# Altium project M3FMCWS.PrjPcb
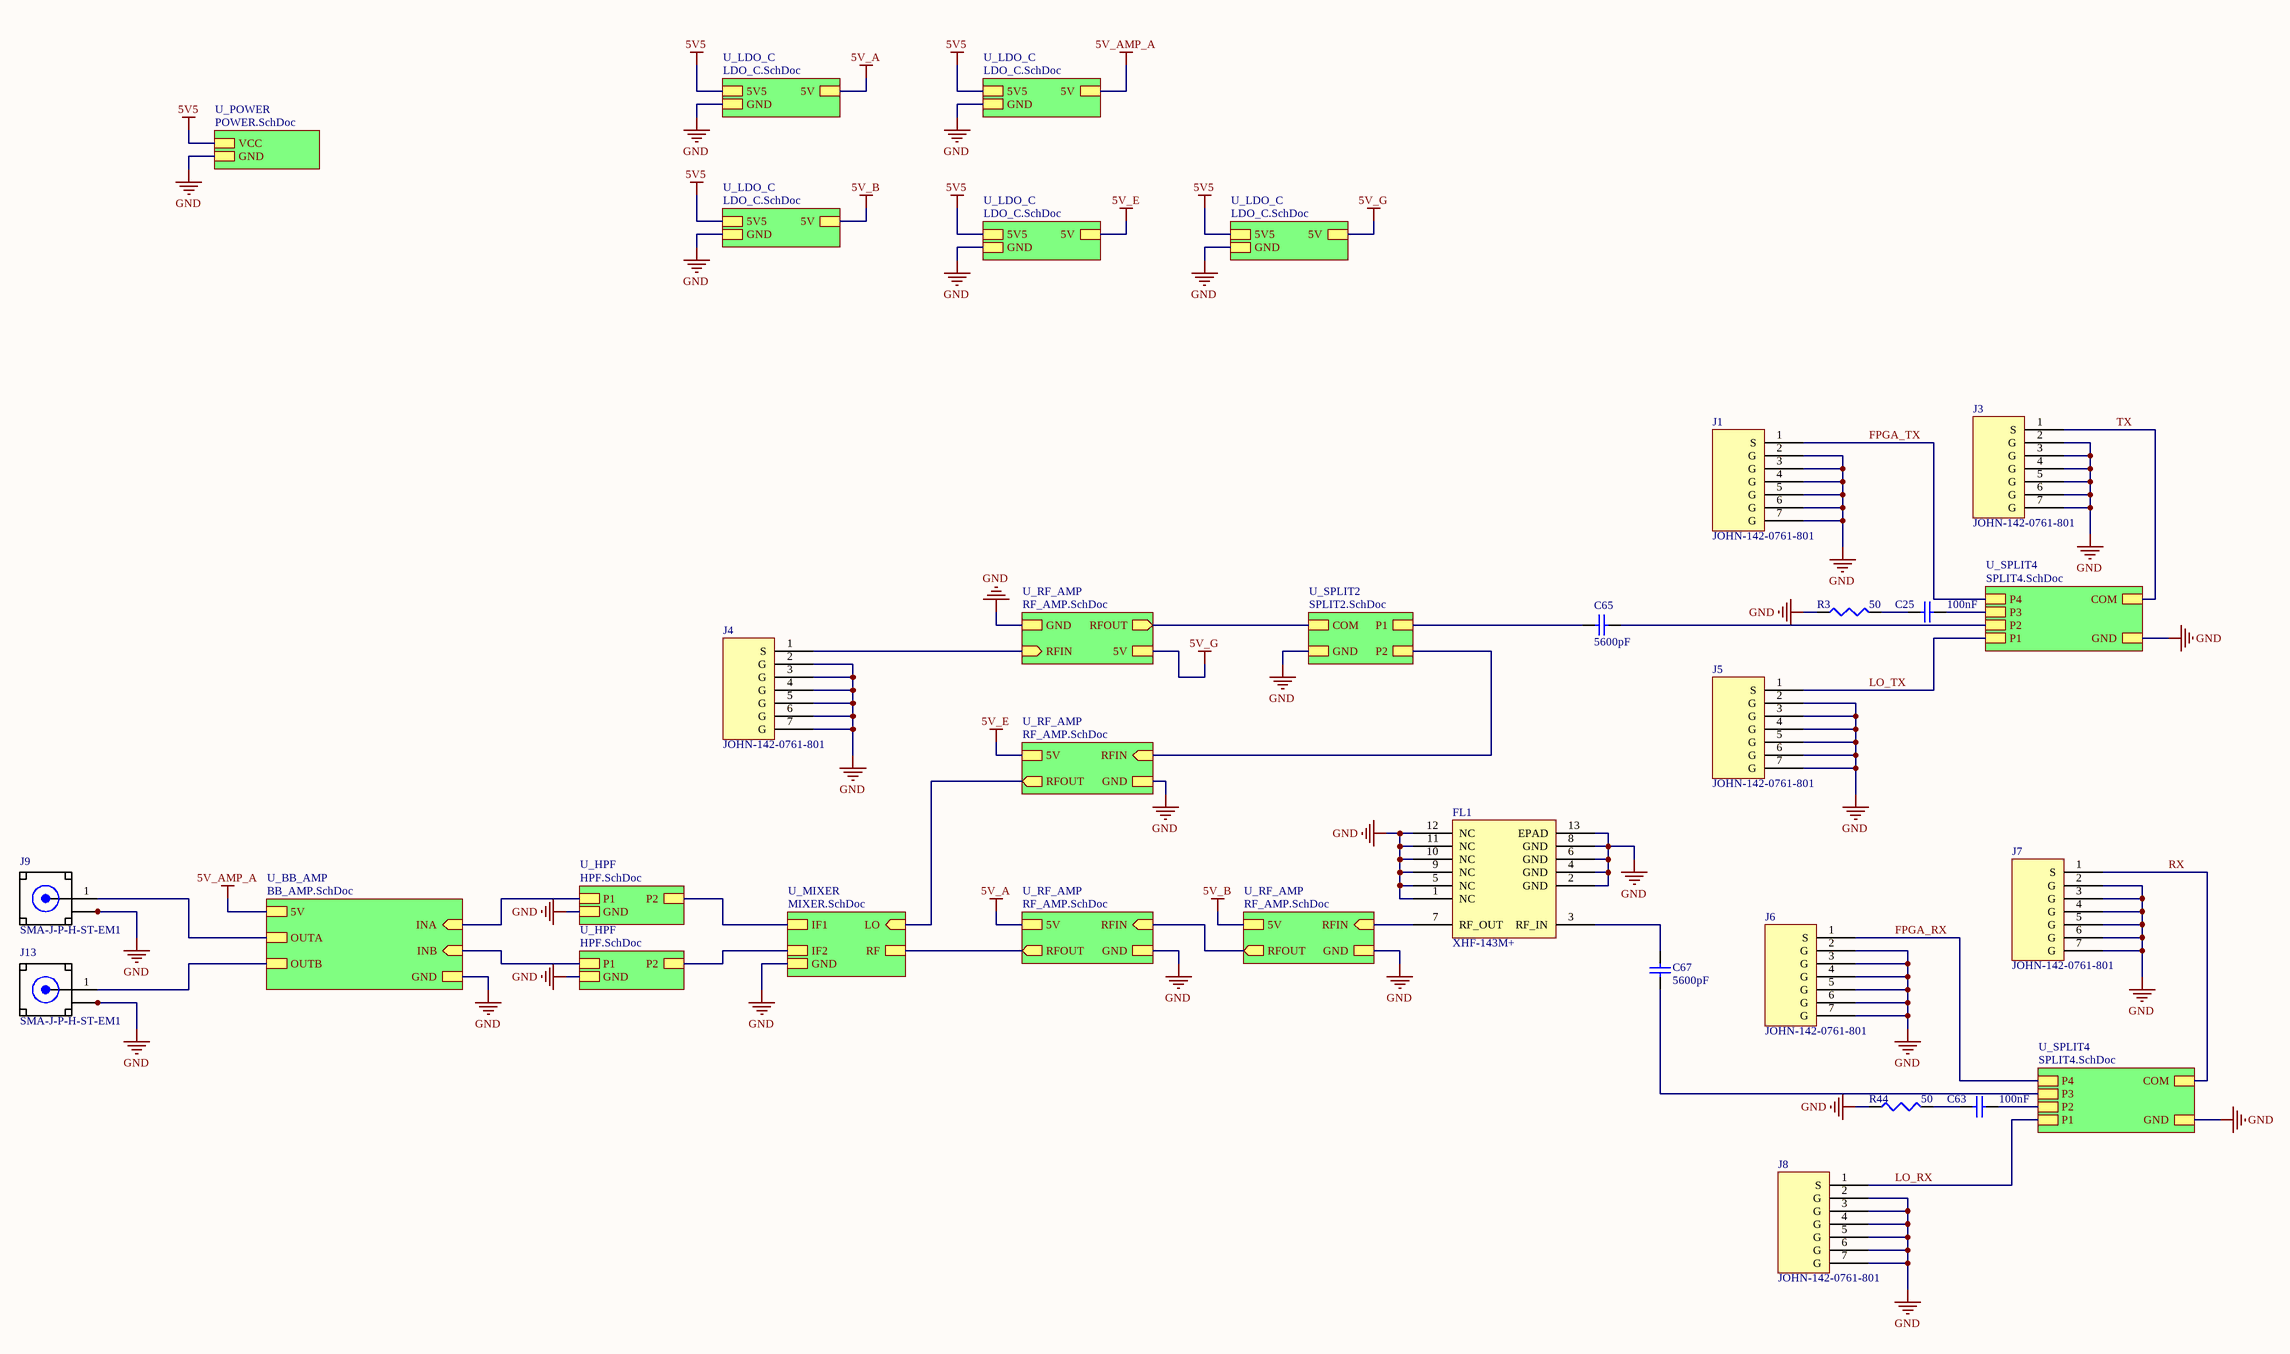
[diagram p0: M3_FMCW.SchDoc]
9 sheets, 145 parts. Net scope: strictly hierarchical (ports join the sheet entries above them; power ports are local).
Board file: M3FMCWS_B.PcbDoc
Sheets:
  M3_FMCW.SchDoc
    U_LDO_C = LDO_C.SchDoc
    U_POWER = POWER.SchDoc
    U_LDO_C = LDO_C.SchDoc
    U_MIXER = MIXER.SchDoc
    U_BB_AMP = BB_AMP.SchDoc
    U_LDO_C = LDO_C.SchDoc
    U_HPF = HPF.SchDoc
    U_HPF = HPF.SchDoc
    U_RF_AMP = RF_AMP.SchDoc
    U_RF_AMP = RF_AMP.SchDoc
    U_SPLIT4 = SPLIT4.SchDoc
    U_SPLIT4 = SPLIT4.SchDoc
    U_RF_AMP = RF_AMP.SchDoc
    U_LDO_C = LDO_C.SchDoc
    U_RF_AMP = RF_AMP.SchDoc
    U_LDO_C = LDO_C.SchDoc
    U_SPLIT2 = SPLIT2.SchDoc

## Sheet M3_FMCW.SchDoc
size C

### Parts
C25  100nF  [SMD-0402]
C63  100nF  [SMD-0402]
C65  5600pF  [Johanson-0201]
C67  5600pF  [Johanson-0201]
FL1  XHF-143M+  [PQFN12-XHF-143M]
J1  JOHN-142-0761-801  [JOHN-142-0761-801]
J3  JOHN-142-0761-801  [JOHN-142-0761-801]
J4  JOHN-142-0761-801  [JOHN-142-0761-801]
J5  JOHN-142-0761-801  [JOHN-142-0761-801]
J6  JOHN-142-0761-801  [JOHN-142-0761-801]
J7  JOHN-142-0761-801  [JOHN-142-0761-801]
J8  JOHN-142-0761-801  [JOHN-142-0761-801]
J9  SMA-J-P-H-ST-EM1  [SMA-J-P-H-ST-EM1]
J13  SMA-J-P-H-ST-EM1  [SMA-J-P-H-ST-EM1]
R3  50  [SMD-0402]
R44  50  [SMD-0402]

### Sub-sheets
U_BB_AMP = BB_AMP.SchDoc: OUTA, OUTB, INA (in), INB (in), 5V, GND
U_HPF = HPF.SchDoc: P1, P2, GND
U_HPF = HPF.SchDoc: P1, P2, GND
U_LDO_C = LDO_C.SchDoc: 5V, 5V5, GND
U_LDO_C = LDO_C.SchDoc: 5V, 5V5, GND
U_LDO_C = LDO_C.SchDoc: 5V, 5V5, GND
U_LDO_C = LDO_C.SchDoc: 5V, 5V5, GND
U_LDO_C = LDO_C.SchDoc: 5V, 5V5, GND
U_MIXER = MIXER.SchDoc: IF1, IF2, LO (in), RF, GND
U_POWER = POWER.SchDoc: GND, VCC
U_RF_AMP = RF_AMP.SchDoc: 5V, RFIN (in), RFOUT (out), GND
U_RF_AMP = RF_AMP.SchDoc: 5V, RFIN (in), RFOUT (out), GND
U_RF_AMP = RF_AMP.SchDoc: 5V, RFIN (in), RFOUT (out), GND
U_RF_AMP = RF_AMP.SchDoc: 5V, RFIN (in), RFOUT (out), GND
U_SPLIT2 = SPLIT2.SchDoc: COM, P1, P2, GND
U_SPLIT4 = SPLIT4.SchDoc: COM, P1, P2, P3, P4, GND
U_SPLIT4 = SPLIT4.SchDoc: COM, P1, P2, P3, P4, GND

### Nets
5V5: sheet U_LDO_C/5V5, sheet U_POWER/VCC, sheet U_LDO_C/5V5, sheet U_LDO_C/5V5, sheet U_LDO_C/5V5, sheet U_LDO_C/5V5
5V_A: sheet U_LDO_C/5V, sheet U_RF_AMP/5V  [project net 5V]
5V_AMP_A: sheet U_BB_AMP/5V, sheet U_LDO_C/5V  [project net 5V]
5V_B: sheet U_LDO_C/5V, sheet U_RF_AMP/5V  [project net 5V]
5V_E: sheet U_RF_AMP/5V, sheet U_LDO_C/5V  [project net 5V]
5V_G: sheet U_RF_AMP/5V, sheet U_LDO_C/5V  [project net 5V]
GND: FL1.1(NC) FL1.2(GND) FL1.4(GND) FL1.5(NC) FL1.6(GND) FL1.8(GND) FL1.9(NC) FL1.10(NC) FL1.11(NC) FL1.12(NC) FL1.13(EPAD) J1.2(G) J1.3(G) J1.4(G) J1.5(G) J1.6(G) J1.7(G) J3.2(G) J3.3(G) J3.4(G) J3.5(G) J3.6(G) J3.7(G) J4.2(G) J4.3(G) J4.4(G) J4.5(G) J4.6(G) J4.7(G) J5.2(G) J5.3(G) J5.4(G) J5.5(G) J5.6(G) J5.7(G) J6.2(G) J6.3(G) J6.4(G) J6.5(G) J6.6(G) J6.7(G) J7.2(G) J7.3(G) J7.4(G) J7.5(G) J7.6(G) J7.7(G) J8.2(G) J8.3(G) J8.4(G) J8.5(G) J8.6(G) J8.7(G) J9.2_1(GND) J9.2_2(GND) J9.3_1(GND) J9.3_2(GND) J13.2_1(GND) J13.2_2(GND) J13.3_1(GND) J13.3_2(GND) R3.1 R44.1 ; sheet U_LDO_C/GND, sheet U_POWER/GND, sheet U_LDO_C/GND, sheet U_MIXER/GND, sheet U_BB_AMP/GND, sheet U_LDO_C/GND, sheet U_HPF/GND, sheet U_HPF/GND, sheet U_RF_AMP/GND, sheet U_RF_AMP/GND, sheet U_SPLIT4/GND, sheet U_SPLIT4/GND, sheet U_RF_AMP/GND, sheet U_LDO_C/GND, sheet U_RF_AMP/GND, sheet U_LDO_C/GND, sheet U_SPLIT2/GND
FPGA_RX: J6.1(S) ; sheet U_SPLIT4/P4
FPGA_TX: J1.1(S) ; sheet U_SPLIT4/P4
LO_RX: J8.1(S) ; sheet U_SPLIT4/P1
LO_TX: J5.1(S) ; sheet U_SPLIT4/P1
RX: J7.1(S) ; sheet U_SPLIT4/COM
TX: J3.1(S) ; sheet U_SPLIT4/COM
NetC24_2: J9.1(SIGNAL) ; sheet U_BB_AMP/OUTA
NetC25_1: C25.1 R3.2
NetC25_2: C25.2 ; sheet U_SPLIT4/P3
NetC26_2: J13.1(SIGNAL) ; sheet U_BB_AMP/OUTB
NetC30_U_HPF1_1: sheet U_BB_AMP/INB, sheet U_HPF/P1
NetC30_U_HPF2_1: sheet U_BB_AMP/INA, sheet U_HPF/P1
NetC62_U_HPF1_2: sheet U_MIXER/IF2, sheet U_HPF/P2
NetC62_U_HPF2_2: sheet U_MIXER/IF1, sheet U_HPF/P2
NetC63_1: C63.1 R44.2
NetC63_2: C63.2 ; sheet U_SPLIT4/P2
NetC65_1: C65.1 ; sheet U_SPLIT4/P2
NetC65_2: C65.2 ; sheet U_SPLIT2/P1
NetC67_1: C67.1 ; sheet U_SPLIT4/P3
NetC67_2: C67.2 FL1.3(RF_IN)
NetFL1_7: FL1.7(RF_OUT) ; sheet U_RF_AMP/RFIN
NetJ4_1: J4.1(S) ; sheet U_RF_AMP/RFIN
NetU1_21: sheet U_RF_AMP/RFOUT, sheet U_SPLIT2/COM
NetU1_29: sheet U_RF_AMP/RFIN, sheet U_SPLIT2/P2
NetU19_16: sheet U_MIXER/RF, sheet U_RF_AMP/RFOUT
NetU19_23: sheet U_MIXER/LO, sheet U_RF_AMP/RFOUT
NetU20_U_RF_AMP3_5: sheet U_RF_AMP/RFIN, sheet U_RF_AMP/RFOUT

### Notes on the sheet
- Title
- Size:
- Date:
- File:
- C
- Number:
- Time:
- Revision:
- Sheet
- of

### Library data of the parts
C25 C63 = CAP_RF_0402: Broadband Ceramic Capacitor X7R 0402 (1005 Metric)
C65 C67 = CAP_RF_0201: Broadband Capacitor 0201 Imperial
FL1 = XHF-143M+: Reflectionless High Pass Filter 50Ω 13900 to19000 MHz
J1 J3-J8 = JOHN-142-0761-801: CONN SMA JACK STR 50OHM EDGE MNT
J9 J13 = SMA-J-P-H-ST-EM1: Connector SMA F 50Ohm Solder ST Edge Mount Gold Over Nickel Tray; MF: Samtec; Price: None; SnapEDA_Link: https://www.snapeda.com/parts/SMA-J-P-H-ST-EM1/Samtec%20Inc./view-part/?ref=snap; MP: SMA-J-P-H-ST-EM1; Package: None; Availability: Unavailable; Value: *
R3 R44 = RES_RF_0402: High Frequency Resistor 0402

## Sheet LDO_C.SchDoc
size B; Organization: Altium Limited; Address1: L3, 12a Rodborough Rd; Address2: Frenchs Forest; Address3: NSW; Address4: Australia 2086
Used 5 times, as channels U_LDO_C, U_LDO_C, U_LDO_C, U_LDO_C, U_LDO_C. Parts and nets are listed once, with the designators drawn on the sheet.
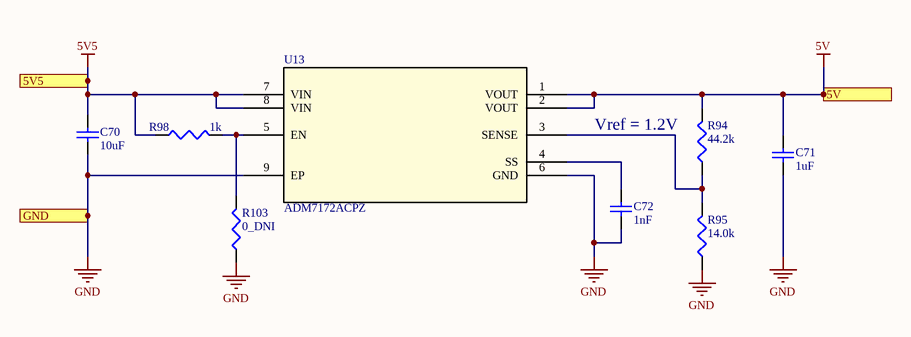
[diagram p1: LDO_C.SchDoc]

### Parts
C70  10uF  [SMD-0603]
C71  1uF  [SMD-0603]
C72  1nF  [SMD-0603]
R94  44.2k  [SMD-0603]
R95  14.0k  [SMD-0603]
R98  1k  [SMD-0603]
R103  0_DNI  [SMD-0603]
U13  ADM7172ACPZ  [LFCSP_WD-8]

### Ports
5V, 5V5, GND

### Nets
5V: C71.2 R94.2 U13.1(VOUT) U13.2(VOUT) ; port 5V
5V5: C70.2 R98.1 U13.7(VIN) U13.8(VIN) ; port 5V5
GND: C70.1 C71.1 C72.2 R95.1 R103.1 U13.6(GND) U13.9(EP) ; port GND
NetC72_1: C72.1 U13.4(SS)
NetR94_1: R94.1 R95.2 U13.3(SENSE)
NetR98_2: R98.2 R103.2 U13.5(EN)

### Channels
U_LDO_C: designators end in _U_LDO_C5; ports 5V5=5V5 5V=5V GND=GND
U_LDO_C: designators end in _U_LDO_C4; ports 5V5=5V5 5V=5V GND=GND
U_LDO_C: designators end in _U_LDO_C3; ports 5V5=5V5 5V=5V GND=GND
U_LDO_C: designators end in _U_LDO_C2; ports 5V5=5V5 5V=5V GND=GND
U_LDO_C: designators end in _U_LDO_C1; ports 5V5=5V5 5V=5V GND=GND

### Notes on the sheet
- (near R94) Vref = 1.2V
- Title
- Size:
- Date:
- B
- Number:
- Time:
- Revision:
- Sheet
- of
- File:

### Library data of the parts
C70-C72 = CAP0603: Ceramic Capacitor 0603
R94 R95 R98 R103 = RES0603: Resistor-0603
U13 = ADM7172ACPZ: 6.5V, 2A, Ultralow Noise, High PSRR, Fast Transient Response CMOS LDO; Value: Value; Type: Type; RefDes: RefDes

## Sheet POWER.SchDoc
size B
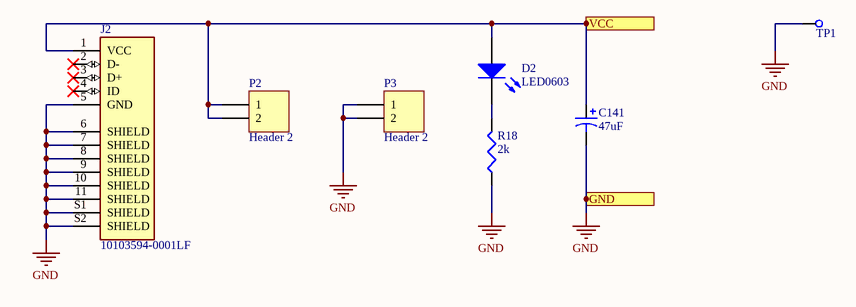
[diagram p2: POWER.SchDoc]

### Parts
C141  47uF  [CAP_TANT_1206_POL]
D2  LED0603  [LED-SMD-0603]
J2  10103594-0001LF  [AMPHENOL_10103594-0001LF]
P2  Header 2  [HDR1X2]
P3  Header 2  [HDR1X2]
R18  2k  [SMD-0402]
TP1  TSW-101-15-T-S  [TSW-101-15-T-S]  (value not drawn)

### Ports
GND, VCC

### Nets
5V5: C141.1 D2.1(A) J2.1(VCC) P2.1 P2.2 ; port VCC
GND: C141.2 J2.5(GND) J2.6(SHIELD) J2.7(SHIELD) J2.8(SHIELD) J2.9(SHIELD) J2.10(SHIELD) J2.11(SHIELD) J2.S1(SHIELD) J2.S2(SHIELD) P3.1 P3.2 R18.1 TP1.1 ; port GND
NetD2_2: D2.2(K) R18.2

Not connected (* = marked no-connect by the designer): J2 2(D-)* 3(D+)* 4(ID)*

### Notes on the sheet
- Title
- Size:
- Date:
- B
- Number:
- Time:
- Revision:
- Sheet
- of
- File:

### Library data of the parts
C141 = CAP_TANT_1206: Polarized Cap, Size 1206 Imperial (3216 Metric), Tantalum
D2 = LED0603: LED 0603
J2 = 10103594-0001LF: USB - micro B USB 2.0 Receptacle Connector 5 Position Surface Mount, Right Angle; Through Hole; MF: Amphenol ICC (FCI); Package: None; MP: 10103594-0001LF; Check_prices: https://www.snapeda.com/parts/10103594-0001LF/Amphenol%20FCI/view-part/5161044/?ref=eda; Purchase-URL: https://pricing.snapeda.com/search/part/10103594-0001LF/?ref=eda; Value: *; Availability: Good; Price: None; SnapEDA_Link: https://www.snapeda.com/parts/10103594-0001LF/Amphenol%20FCI/view-part/5161044/?ref=snap
P2 P3 = Header 2: Header, 2-Pin; LatestRevisionDate: 17-Jul-2002; LatestRevisionNote: Re-released for DXP Platform.; Publisher: Altium Limited
R18 = RES0402: Resistor-0402
TP1 = TSW-101-15-T-S: CONN HEADER VERT 1POS

## Sheet MIXER.SchDoc
size 431 x 279 mm
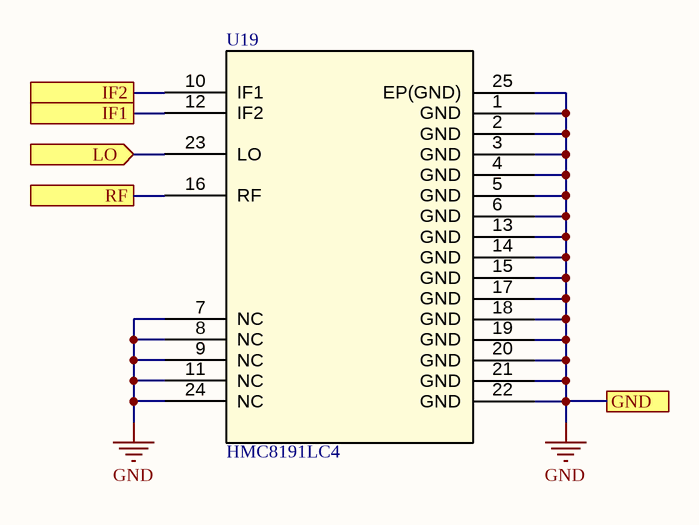
[diagram p3: MIXER.SchDoc]

### Parts
U19  HMC8191LC4  [HMC8191_E-24-1]

### Ports
GND, IF1, IF2, LO (in), RF

### Nets
GND: U19.1(GND) U19.2(GND) U19.3(GND) U19.4(GND) U19.5(GND) U19.6(GND) U19.7(NC) U19.8(NC) U19.9(NC) U19.11(NC) U19.13(GND) U19.14(GND) U19.15(GND) U19.17(GND) U19.18(GND) U19.19(GND) U19.20(GND) U19.21(GND) U19.22(GND) U19.24(NC) U19.25(EP(GND)) ; port GND
NetC62_U_HPF1_2: U19.10(IF1) ; port IF2
NetC62_U_HPF2_2: U19.12(IF2) ; port IF1
NetU19_16: U19.16(RF) ; port RF
NetU19_23: U19.23(LO) ; port LO

### Notes on the sheet
- DWG. NO.
- REV.
- SHT.
- THIS DOCUMENT AND THE DATA DISCLOSED HEREIN OR HEREWITH IS THE PROPERTY OF ALTIUM LIMITED AND MAY BE FREELY DISTRIBUTED IN WHOLE. NO RIGHTS ARE RESERVED OR EXPRESS OR IMPLIED WARANTEE GIVEN.
- REVISION
- DESCRIPTION
- DATE
- APPROVED
- ENG:
- APPROVALS
- PROJECT
- DSN:
- CHK:
- REFERENCE DOCUMENTS
- PROJECT REVISION:
- TITLE
- DOCUMENT REVISION:
- DESIGN ITEM:
- BOM:
- FAB DWG:
- PCB DWG:
- ASSY DWG:
- SCALE:
- SIZE
- B
- CAGE CODE
- FILE NAME
- DWG NO.
- SHEET
- OF
- REV

### Library data of the parts
U19 = HMC8191LC4: 6 GHz to 26.5 GHz, / Wideband I/Q Mixer; Copyright: Copyright (C) 2018 Accelerated Designs. All rights reserved; RefDes: RefDes; Type: DEV

## Sheet BB_AMP.SchDoc
size 431 x 279 mm
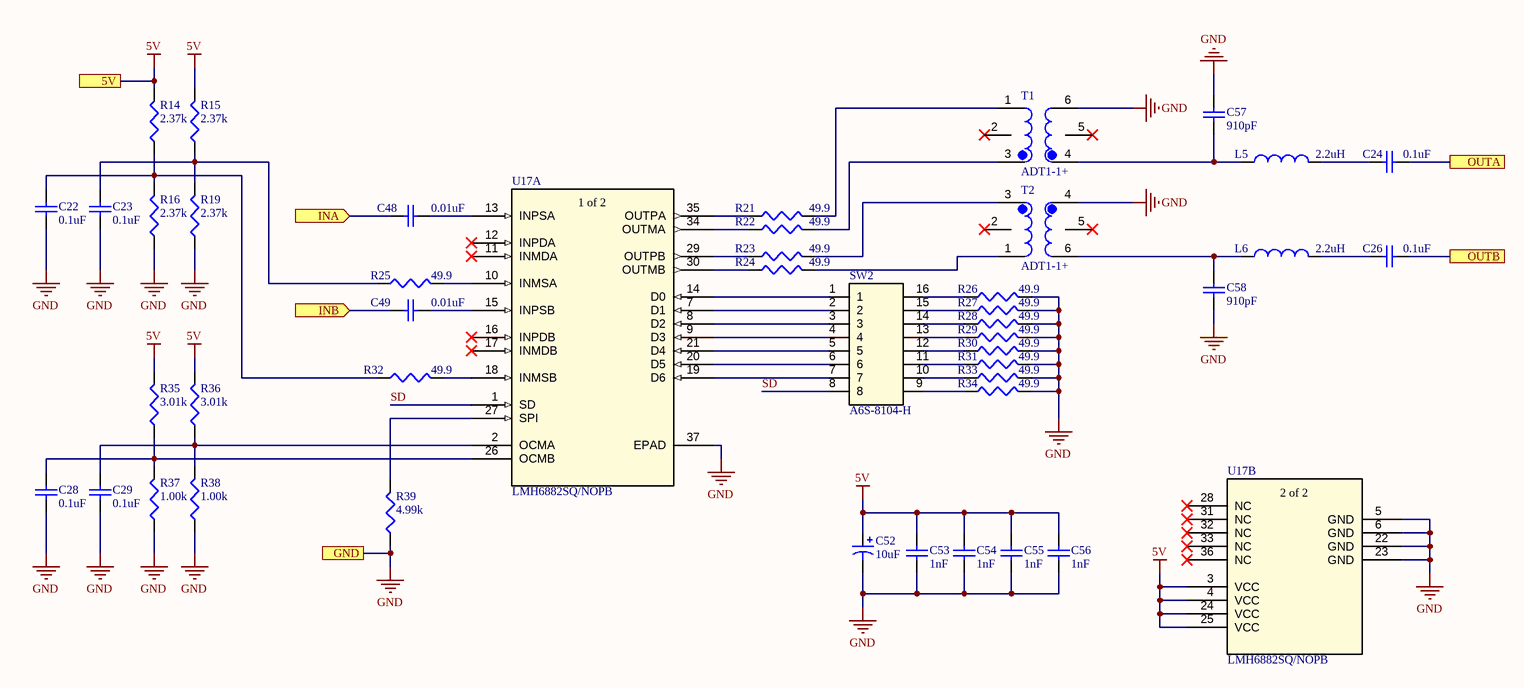
[diagram p4: BB_AMP.SchDoc]

### Parts
C22  0.1uF  [SMD-0603]
C23  0.1uF  [SMD-0603]
C24  0.1uF  [SMD-0603]
C26  0.1uF  [SMD-0603]
C28  0.1uF  [SMD-0603]
C29  0.1uF  [SMD-0603]
C48  0.01uF  [SMD-0402]
C49  0.01uF  [SMD-0402]
C52  10uF  [CAP_TANT_1206_POL]
C53  1nF  [SMD-0402]
C54  1nF  [SMD-0402]
C55  1nF  [SMD-0402]
C56  1nF  [SMD-0402]
C57  910pF  [SMD-0603]
C58  910pF  [SMD-0603]
L5  2.2uH  [SMD-0603]
L6  2.2uH  [SMD-0603]
R14  2.37k  [SMD-0603]
R15  2.37k  [SMD-0603]
R16  2.37k  [SMD-0603]
R19  2.37k  [SMD-0603]
R21  49.9  [SMD-0402]
R22  49.9  [SMD-0402]
R23  49.9  [SMD-0402]
R24  49.9  [SMD-0402]
R25  49.9  [SMD-0402]
R26  49.9  [SMD-0603]
R27  49.9  [SMD-0603]
R28  49.9  [SMD-0603]
R29  49.9  [SMD-0603]
R30  49.9  [SMD-0603]
R31  49.9  [SMD-0603]
R32  49.9  [SMD-0402]
R33  49.9  [SMD-0603]
R34  49.9  [SMD-0603]
R35  3.01k  [SMD-0603]
R36  3.01k  [SMD-0603]
R37  1.00k  [SMD-0603]
R38  1.00k  [SMD-0603]
R39  4.99k  [SMD-0603]
SW2  A6S-8104-H  [A6S-8101-H]
T1  ADT1-1+  [XFMR_ADT1-1+]
T2  ADT1-1+  [XFMR_ADT1-1+]
U17  LMH6882SQ/NOPB  [NJK36_TEX]  (parts A,B of 2)

### Ports
5V, GND, INA (in), INB (in), OUTA, OUTB

### Nets
5V: C52.1 C53.2 C54.2 C55.2 C56.2 R14.2 R15.2 R35.2 R36.2 U17.3(VCC) U17.4(VCC) U17.24(VCC) U17.25(VCC) ; port 5V
GND: C22.1 C23.1 C28.1 C29.1 C52.2 C53.1 C54.1 C55.1 C56.1 C57.2 C58.1 R16.1 R19.1 R26.2 R27.2 R28.2 R29.2 R30.2 R31.2 R33.2 R34.2 R37.1 R38.1 R39.1 T1.6 T2.4 U17.5(GND) U17.6(GND) U17.22(GND) U17.23(GND) U17.37(EPAD) ; port GND
SD: SW2.8 U17.1(SD)
NetC22_2: C22.2 R14.1 R16.2 R32.1
NetC23_2: C23.2 R15.1 R19.2 R25.1
NetC24_1: C24.1 L5.2
NetC24_2: C24.2 ; port OUTA
NetC26_1: C26.1 L6.2
NetC26_2: C26.2 ; port OUTB
NetC28_2: C28.2 R35.1 R37.2 U17.26(OCMB)
NetC29_2: C29.2 R36.1 R38.2 U17.2(OCMA)
NetC30_U_HPF1_1: C49.1 ; port INB
NetC30_U_HPF2_1: C48.1 ; port INA
NetC48_2: C48.2 U17.13(INPSA)
NetC49_2: C49.2 U17.15(INPSB)
NetC57_1: C57.1 L5.1 T1.4
NetC58_2: C58.2 L6.1 T2.6
NetR21_1: R21.1 U17.35(OUTPA)
NetR21_2: R21.2 T1.1
NetR22_1: R22.1 U17.34(OUTMA)
NetR22_2: R22.2 T1.3
NetR23_1: R23.1 U17.29(OUTPB)
NetR23_2: R23.2 T2.3
NetR24_1: R24.1 U17.30(OUTMB)
NetR24_2: R24.2 T2.1
NetR25_2: R25.2 U17.10(INMSA)
NetR26_1: R26.1 SW2.16
NetR27_1: R27.1 SW2.15
NetR28_1: R28.1 SW2.14
NetR29_1: R29.1 SW2.13
NetR30_1: R30.1 SW2.12
NetR31_1: R31.1 SW2.11
NetR32_2: R32.2 U17.18(INMSB)
NetR33_1: R33.1 SW2.10
NetR34_1: R34.1 SW2.9
NetR39_2: R39.2 U17.27(SPI)
NetSW2_1: SW2.1 U17.14(D0)
NetSW2_2: SW2.2 U17.7(D1)
NetSW2_3: SW2.3 U17.8(D2)
NetSW2_4: SW2.4 U17.9(D3)
NetSW2_5: SW2.5 U17.21(D4)
NetSW2_6: SW2.6 U17.20(D5)
NetSW2_7: SW2.7 U17.19(D6)

Not connected (* = marked no-connect by the designer): T1 2(NC)* 5*; T2 2(NC)* 5*; U17 11(INMDA)* 12(INPDA)* 16(INPDB)* 17(INMDB)* 28(NC)* 31(NC)* 32(NC)* 33(NC)* 36(NC)*

### Notes on the sheet
- DWG. NO.
- REV.
- SHT.
- THIS DOCUMENT AND THE DATA DISCLOSED HEREIN OR HEREWITH IS THE PROPERTY OF ALTIUM LIMITED AND MAY BE FREELY DISTRIBUTED IN WHOLE. NO RIGHTS ARE RESERVED OR EXPRESS OR IMPLIED WARANTEE GIVEN.
- REVISION
- DESCRIPTION
- DATE
- APPROVED
- ENG:
- APPROVALS
- PROJECT
- DSN:
- CHK:
- REFERENCE DOCUMENTS
- PROJECT REVISION:
- TITLE
- DOCUMENT REVISION:
- DESIGN ITEM:
- BOM:
- FAB DWG:
- PCB DWG:
- ASSY DWG:
- SCALE:
- SIZE
- B
- CAGE CODE
- FILE NAME
- DWG NO.
- SHEET
- OF
- REV
- (in symbol LMH6882, part A) 1 of 2
- (in symbol LMH6882, part B) 2 of 2

### Library data of the parts
C22-C24 C26 C28 C29 C57 C58 = CAP0603: Ceramic Capacitor 0603
C48 C49 C53-C56 = CAP0402: Ceramic Capacitor 0402
C52 = CAP_TANT_1206: as C141 on sheet POWER
L5 L6 = L0603: Inductor 0603
R14-R16 R19 R26-R31 R33-R39 = RES0603: Resistor-0603
R21-R25 R32 = RES0402: Resistor-0402
SW2 = A6S-8104-H: Dip Switch SPST 8 Position Surface Mount Slide (Standard) Actuator 25mA 24VDC; Vendor: Omron; Built_By: EMA_Kyle; SourceLibrary: Omron_2019-09-26; Manufacturer_Part_Number: A6S-8104-H; Copyright: Copyright (C) 2018 Accelerated Designs. All rights reserved; RefDes: RefDes; Type: DEV
T1 T2 = ADT1-1+: RF Transformer, 50 ohm, 1:1, 0.15-400 MHz, SMT; MP: ADT1-6T+; MF: Mini-Circuits; SnapEDA_Link: https://www.snapeda.com/parts/ADT1-6T+/Mini-Circuits/view-part/948642/?ref=snap; Availability: Unavailable; Price: None; Value: *; Package: None
U17 = LMH6882: LMH6882 DC to 2.4-GHz, High-Linearity, Dual, Programmable Differential Amplifier; SourceLibrary: TI_2017-02-16; Built_By: EMA_UL_Team; Vendor: Texas Instruments; Manufacturer_Part_Number: LMH6882SQ/NOPB; Copyright: Copyright (C) 2018 Accelerated Designs. All rights reserved; RefDes: RefDes; Type: DEV

## Sheet HPF.SchDoc
size 431 x 279 mm
Used 2 times, as channels U_HPF, U_HPF. Parts and nets are listed once, with the designators drawn on the sheet.
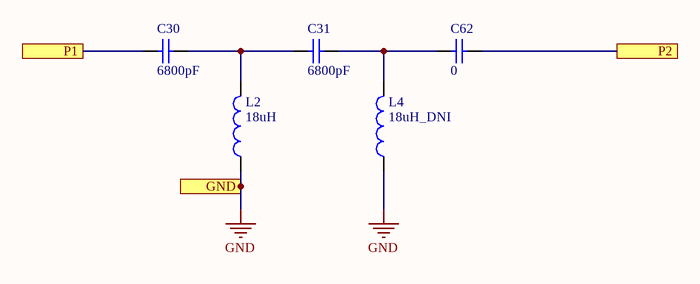
[diagram p5: HPF.SchDoc]

### Parts
C30  6800pF  [SMD-0603]
C31  6800pF  [SMD-0603]
C62  0  [SMD-0603]
L2  18uH  [SMD-0603]
L4  18uH_DNI  [SMD-0603]

### Ports
GND, P1, P2

### Nets
GND: L2.1 L4.1 ; port GND
P1: C30.1 ; port P1
P2: C62.2 ; port P2
NetC30_2: C30.2 C31.1 L2.2
NetC31_2: C31.2 C62.1 L4.2

### Channels
U_HPF: designators end in _U_HPF2; ports GND=GND P1=NetC30_U_HPF2_1 P2=NetC62_U_HPF2_2
U_HPF: designators end in _U_HPF1; ports GND=GND P1=NetC30_U_HPF1_1 P2=NetC62_U_HPF1_2

### Notes on the sheet
- DWG. NO.
- REV.
- SHT.
- THIS DOCUMENT AND THE DATA DISCLOSED HEREIN OR HEREWITH IS THE PROPERTY OF ALTIUM LIMITED AND MAY BE FREELY DISTRIBUTED IN WHOLE. NO RIGHTS ARE RESERVED OR EXPRESS OR IMPLIED WARANTEE GIVEN.
- REVISION
- DESCRIPTION
- DATE
- APPROVED
- ENG:
- APPROVALS
- PROJECT
- DSN:
- CHK:
- REFERENCE DOCUMENTS
- PROJECT REVISION:
- TITLE
- DOCUMENT REVISION:
- DESIGN ITEM:
- BOM:
- FAB DWG:
- PCB DWG:
- ASSY DWG:
- SCALE:
- SIZE
- B
- CAGE CODE
- FILE NAME
- DWG NO.
- SHEET
- OF
- REV

### Library data of the parts
C30 C31 C62 = CAP0603: Ceramic Capacitor 0603
L2 L4 = L0603: Inductor 0603

## Sheet RF_AMP.SchDoc
size 431 x 279 mm
Used 4 times, as channels U_RF_AMP, U_RF_AMP, U_RF_AMP, U_RF_AMP. Parts and nets are listed once, with the designators drawn on the sheet.
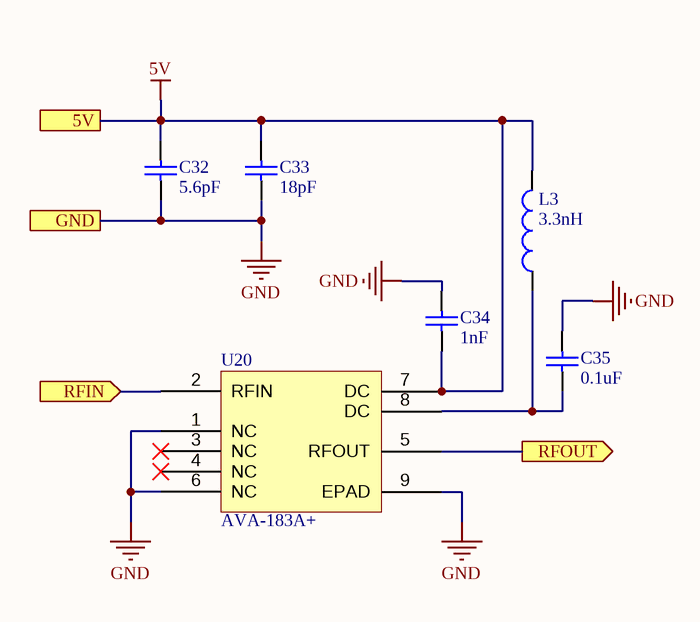
[diagram p6: RF_AMP.SchDoc]

### Parts
C32  5.6pF  [SMD-0402]
C33  18pF  [SMD-0402]
C34  1nF  [SMD-0402]
C35  0.1uF  [SMD-0402]
L3  3.3nH  [SMD-0805]
U20  AVA-183A+  [AVA-183A+ QFN]

### Ports
5V, GND, RFIN (in), RFOUT (out)

### Nets
5V: C32.2 C33.2 C34.1 L3.2 U20.7(DC) ; port 5V
GND: C32.1 C33.1 C34.2 C35.2 U20.1(NC) U20.6(NC) U20.9(EPAD) ; port GND
RFIN: U20.2(RFIN) ; port RFIN
RFOUT: U20.5(RFOUT) ; port RFOUT
NetC35_1: C35.1 L3.1 U20.8(DC)

Not connected (* = marked no-connect by the designer): U20 3(NC)* 4(NC)*

### Channels
U_RF_AMP: designators end in _U_RF_AMP4; ports 5V=5V GND=GND RFIN=NetU20_U_RF_AMP3_5 RFOUT=NetU19_16
U_RF_AMP: designators end in _U_RF_AMP3; ports 5V=5V GND=GND RFIN=NetFL1_7 RFOUT=NetU20_U_RF_AMP3_5
U_RF_AMP: designators end in _U_RF_AMP2; ports 5V=5V GND=GND RFIN=NetU1_29 RFOUT=NetU19_23
U_RF_AMP: designators end in _U_RF_AMP1; ports 5V=5V GND=GND RFIN=NetJ4_1 RFOUT=NetU1_21

### Notes on the sheet
- DWG. NO.
- REV.
- SHT.
- THIS DOCUMENT AND THE DATA DISCLOSED HEREIN OR HEREWITH IS THE PROPERTY OF ALTIUM LIMITED AND MAY BE FREELY DISTRIBUTED IN WHOLE. NO RIGHTS ARE RESERVED OR EXPRESS OR IMPLIED WARANTEE GIVEN.
- REVISION
- DESCRIPTION
- DATE
- APPROVED
- ENG:
- APPROVALS
- PROJECT
- DSN:
- CHK:
- REFERENCE DOCUMENTS
- PROJECT REVISION:
- TITLE
- DOCUMENT REVISION:
- DESIGN ITEM:
- BOM:
- FAB DWG:
- PCB DWG:
- ASSY DWG:
- SCALE:
- SIZE
- B
- CAGE CODE
- FILE NAME
- DWG NO.
- SHEET
- OF
- REV

### Library data of the parts
C32-C35 = CAP0402: Ceramic Capacitor 0402
L3 = L0805: Inductor 0805
U20 = AVA-183A+: Wideband, Microwave, Monolithic Amplifier, 50Ω, 5 to 18 GHz

## Sheet SPLIT4.SchDoc
size 431 x 279 mm
Used 2 times, as channels U_SPLIT4, U_SPLIT4. Parts and nets are listed once, with the designators drawn on the sheet.
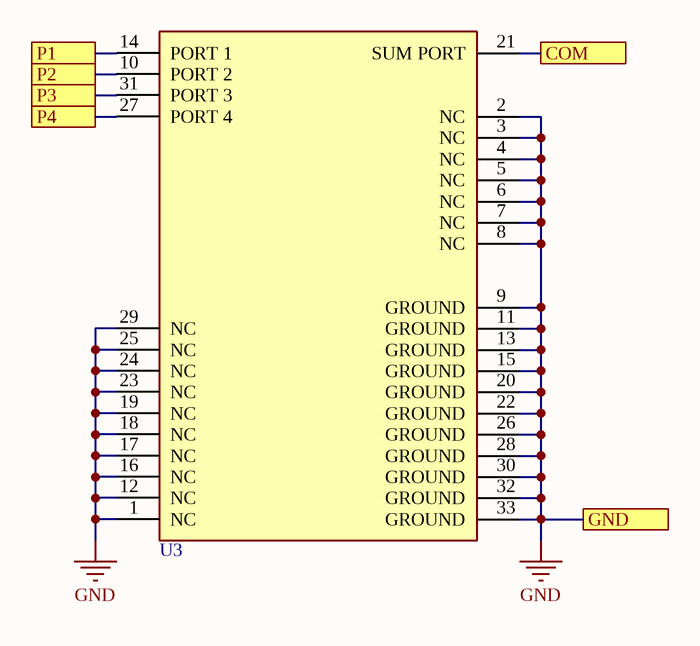
[diagram p7: SPLIT4.SchDoc]

### Parts
U3  EP4RKU+  [EP4RKU+]  (value not drawn)

### Ports
COM, GND, P1, P2, P3, P4

### Nets
GND: U3.1(NC) U3.2(NC) U3.3(NC) U3.4(NC) U3.5(NC) U3.6(NC) U3.7(NC) U3.8(NC) U3.9(GROUND) U3.11(GROUND) U3.12(NC) U3.13(GROUND) U3.15(GROUND) U3.16(NC) U3.17(NC) U3.18(NC) U3.19(NC) U3.20(GROUND) U3.22(GROUND) U3.23(NC) U3.24(NC) U3.25(NC) U3.26(GROUND) U3.28(GROUND) U3.29(NC) U3.30(GROUND) U3.32(GROUND) U3.33(GROUND) ; port GND
COM: U3.21(SUM_PORT) ; port COM
P1: U3.14(PORT_1) ; port P1
P2: U3.10(PORT_2) ; port P2
P3: U3.31(PORT_3) ; port P3
P4: U3.27(PORT_4) ; port P4

### Channels
U_SPLIT4: designators end in _U_SPLIT42; ports COM=TX GND=GND P1=LO_TX P2=NetC65_1 P3=NetC25_2 P4=FPGA_TX
U_SPLIT4: designators end in _U_SPLIT41; ports COM=RX GND=GND P1=LO_RX P2=NetC63_2 P3=NetC67_1 P4=FPGA_RX

### Notes on the sheet
- DWG. NO.
- REV.
- SHT.
- THIS DOCUMENT AND THE DATA DISCLOSED HEREIN OR HEREWITH IS THE PROPERTY OF ALTIUM LIMITED AND MAY BE FREELY DISTRIBUTED IN WHOLE. NO RIGHTS ARE RESERVED OR EXPRESS OR IMPLIED WARANTEE GIVEN.
- REVISION
- DESCRIPTION
- DATE
- APPROVED
- ENG:
- APPROVALS
- PROJECT
- DSN:
- CHK:
- REFERENCE DOCUMENTS
- PROJECT REVISION:
- TITLE
- DOCUMENT REVISION:
- DESIGN ITEM:
- BOM:
- FAB DWG:
- PCB DWG:
- ASSY DWG:
- SCALE:
- SIZE
- B
- CAGE CODE
- FILE NAME
- DWG NO.
- SHEET
- OF
- REV

### Library data of the parts
U3 = EP4RKU+: Power Splitter/Combiner 4 Way-0° 50Ω DC to 18 GHz

## Sheet SPLIT2.SchDoc
size 431 x 279 mm
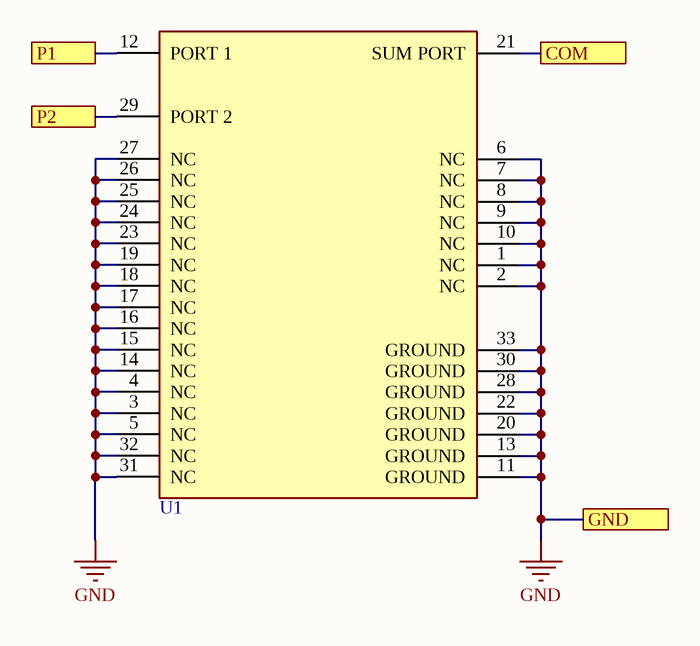
[diagram p8: SPLIT2.SchDoc]

### Parts
U1  EP2RKU+  [EP2RKU+]  (value not drawn)

### Ports
COM, GND, P1, P2

### Nets
GND: U1.1(NC) U1.2(NC) U1.3(NC) U1.4(NC) U1.5(NC) U1.6(NC) U1.7(NC) U1.8(NC) U1.9(NC) U1.10(NC) U1.11(GROUND) U1.13(GROUND) U1.14(NC) U1.15(NC) U1.16(NC) U1.17(NC) U1.18(NC) U1.19(NC) U1.20(GROUND) U1.22(GROUND) U1.23(NC) U1.24(NC) U1.25(NC) U1.26(NC) U1.27(NC) U1.28(GROUND) U1.30(GROUND) U1.31(NC) U1.32(NC) U1.33(GROUND) ; port GND
NetC65_2: U1.12(PORT_1) ; port P1
NetU1_21: U1.21(SUM_PORT) ; port COM
NetU1_29: U1.29(PORT_2) ; port P2

### Notes on the sheet
- DWG. NO.
- REV.
- SHT.
- THIS DOCUMENT AND THE DATA DISCLOSED HEREIN OR HEREWITH IS THE PROPERTY OF ALTIUM LIMITED AND MAY BE FREELY DISTRIBUTED IN WHOLE. NO RIGHTS ARE RESERVED OR EXPRESS OR IMPLIED WARANTEE GIVEN.
- REVISION
- DESCRIPTION
- DATE
- APPROVED
- ENG:
- APPROVALS
- PROJECT
- DSN:
- CHK:
- REFERENCE DOCUMENTS
- PROJECT REVISION:
- TITLE
- DOCUMENT REVISION:
- DESIGN ITEM:
- BOM:
- FAB DWG:
- PCB DWG:
- ASSY DWG:
- SCALE:
- SIZE
- B
- CAGE CODE
- FILE NAME
- DWG NO.
- SHEET
- OF
- REV

### Library data of the parts
U1 = EP2RKU+: 2 Ways MMIC Power Splitter, DC - 18000 MHz, 50Ω

## Nets that join several sheets
5V: U_LDO_C (C71_U_LDO_C5.2 R94_U_LDO_C5.2 U13_U_LDO_C5.1 U13_U_LDO_C5.2), U_RF_AMP (5 pins)
5V: U_LDO_C (C71_U_LDO_C4.2 R94_U_LDO_C4.2 U13_U_LDO_C4.1 U13_U_LDO_C4.2), U_RF_AMP (5 pins)
5V: BB_AMP (13 pins), U_LDO_C (C71_U_LDO_C3.2 R94_U_LDO_C3.2 U13_U_LDO_C3.1 U13_U_LDO_C3.2)
5V: U_RF_AMP (5 pins), U_LDO_C (C71_U_LDO_C2.2 R94_U_LDO_C2.2 U13_U_LDO_C2.1 U13_U_LDO_C2.2)
5V: U_RF_AMP (5 pins), U_LDO_C (C71_U_LDO_C1.2 R94_U_LDO_C1.2 U13_U_LDO_C1.1 U13_U_LDO_C1.2)
5V5: U_LDO_C (C70_U_LDO_C5.2 R98_U_LDO_C5.1 U13_U_LDO_C5.7 U13_U_LDO_C5.8), POWER (5 pins), U_LDO_C (C70_U_LDO_C4.2 R98_U_LDO_C4.1 U13_U_LDO_C4.7 U13_U_LDO_C4.8), U_LDO_C (C70_U_LDO_C3.2 R98_U_LDO_C3.1 U13_U_LDO_C3.7 U13_U_LDO_C3.8), U_LDO_C (C70_U_LDO_C2.2 R98_U_LDO_C2.1 U13_U_LDO_C2.7 U13_U_LDO_C2.8), U_LDO_C (C70_U_LDO_C1.2 R98_U_LDO_C1.1 U13_U_LDO_C1.7 U13_U_LDO_C1.8)
GND: M3_FMCW (63 pins), U_LDO_C (7 pins), POWER (14 pins), U_LDO_C (7 pins), MIXER (21 pins), BB_AMP (31 pins), U_LDO_C (7 pins), U_HPF (L2_U_HPF2.1 L4_U_HPF2.1), U_HPF (L2_U_HPF1.1 L4_U_HPF1.1), U_RF_AMP (7 pins), U_RF_AMP (7 pins), U_SPLIT4 (28 pins), U_SPLIT4 (28 pins), U_RF_AMP (7 pins), U_LDO_C (7 pins), U_RF_AMP (7 pins), U_LDO_C (7 pins), SPLIT2 (30 pins)
FPGA_RX: M3_FMCW (J6.1), U_SPLIT4 (U3_U_SPLIT41.27)
FPGA_TX: M3_FMCW (J1.1), U_SPLIT4 (U3_U_SPLIT42.27)
LO_RX: M3_FMCW (J8.1), U_SPLIT4 (U3_U_SPLIT41.14)
LO_TX: M3_FMCW (J5.1), U_SPLIT4 (U3_U_SPLIT42.14)
NetC24_2: M3_FMCW (J9.1), BB_AMP (C24.2)
NetC25_2: M3_FMCW (C25.2), U_SPLIT4 (U3_U_SPLIT42.31)
NetC26_2: M3_FMCW (J13.1), BB_AMP (C26.2)
NetC30_U_HPF1_1: BB_AMP (C49.1), U_HPF (C30_U_HPF1.1)
NetC30_U_HPF2_1: BB_AMP (C48.1), U_HPF (C30_U_HPF2.1)
NetC62_U_HPF1_2: MIXER (U19.10), U_HPF (C62_U_HPF1.2)
NetC62_U_HPF2_2: MIXER (U19.12), U_HPF (C62_U_HPF2.2)
NetC63_2: M3_FMCW (C63.2), U_SPLIT4 (U3_U_SPLIT41.10)
NetC65_1: M3_FMCW (C65.1), U_SPLIT4 (U3_U_SPLIT42.10)
NetC65_2: M3_FMCW (C65.2), SPLIT2 (U1.12)
NetC67_1: M3_FMCW (C67.1), U_SPLIT4 (U3_U_SPLIT41.31)
NetFL1_7: M3_FMCW (FL1.7), U_RF_AMP (U20_U_RF_AMP3.2)
NetJ4_1: M3_FMCW (J4.1), U_RF_AMP (U20_U_RF_AMP1.2)
NetU1_21: U_RF_AMP (U20_U_RF_AMP1.5), SPLIT2 (U1.21)
NetU1_29: U_RF_AMP (U20_U_RF_AMP2.2), SPLIT2 (U1.29)
NetU19_16: MIXER (U19.16), U_RF_AMP (U20_U_RF_AMP4.5)
NetU19_23: MIXER (U19.23), U_RF_AMP (U20_U_RF_AMP2.5)
NetU20_U_RF_AMP3_5: U_RF_AMP (U20_U_RF_AMP4.2), U_RF_AMP (U20_U_RF_AMP3.5)
RX: M3_FMCW (J7.1), U_SPLIT4 (U3_U_SPLIT41.21)
TX: M3_FMCW (J3.1), U_SPLIT4 (U3_U_SPLIT42.21)